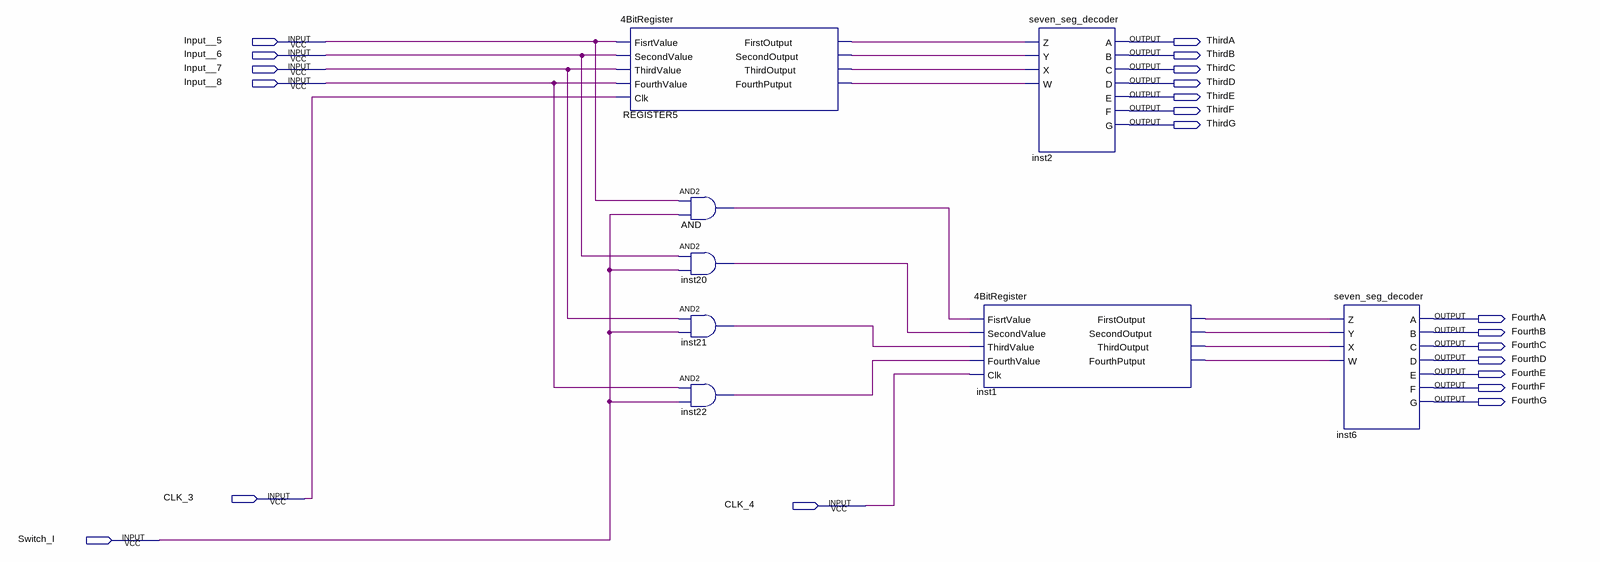
[diagram p0: schematic sheet]
// Quartus schematic Registers_2_3.bdf as structural Verilog: 8 symbols, 21 pins
module Registers_2_3 (
  input  Input__5,
  input  Input__6,
  input  Input__7,
  input  Input__8,
  input  CLK_3,
  input  CLK_4,
  input  Switch_I,
  output ThirdA,
  output ThirdB,
  output ThirdC,
  output ThirdD,
  output ThirdE,
  output ThirdF,
  output ThirdG,
  output FourthA,
  output FourthB,
  output FourthC,
  output FourthD,
  output FourthE,
  output FourthF,
  output FourthG
);

  wire AND_out, inst1_firstoutput, inst1_fourthputput, inst1_secondoutput, inst1_thirdoutput, inst20_out,
       inst21_out, inst22_out, REGISTER5_firstoutput, REGISTER5_fourthputput, REGISTER5_secondoutput,
       REGISTER5_thirdoutput;

  \4BitRegister  REGISTER5 (
    .FisrtValue(Input__5), .SecondValue(Input__6), .ThirdValue(Input__7), .FourthValue(Input__8),
    .Clk(CLK_3), .FirstOutput(REGISTER5_firstoutput), .SecondOutput(REGISTER5_secondoutput),
    .ThirdOutput(REGISTER5_thirdoutput), .FourthPutput(REGISTER5_fourthputput));
  and AND (AND_out, Input__5, Switch_I);
  and inst20 (inst20_out, Input__6, Switch_I);
  and inst21 (inst21_out, Input__7, Switch_I);
  and inst22 (inst22_out, Input__8, Switch_I);
  \4BitRegister  inst1 (
    .FisrtValue(AND_out), .SecondValue(inst20_out), .ThirdValue(inst21_out), .FourthValue(inst22_out),
    .Clk(CLK_4), .FirstOutput(inst1_firstoutput), .SecondOutput(inst1_secondoutput),
    .ThirdOutput(inst1_thirdoutput), .FourthPutput(inst1_fourthputput));
  seven_seg_decoder inst2 (
    .Z(REGISTER5_firstoutput), .Y(REGISTER5_secondoutput), .X(REGISTER5_thirdoutput),
    .W(REGISTER5_fourthputput), .A(ThirdA), .B(ThirdB), .C(ThirdC), .D(ThirdD), .E(ThirdE), .F(ThirdF),
    .G(ThirdG));
  seven_seg_decoder inst6 (
    .Z(inst1_firstoutput), .Y(inst1_secondoutput), .X(inst1_thirdoutput), .W(inst1_fourthputput),
    .A(FourthA), .B(FourthB), .C(FourthC), .D(FourthD), .E(FourthE), .F(FourthF), .G(FourthG));
endmodule
